# EAGLE design generator (EAGLE 7.1.0)
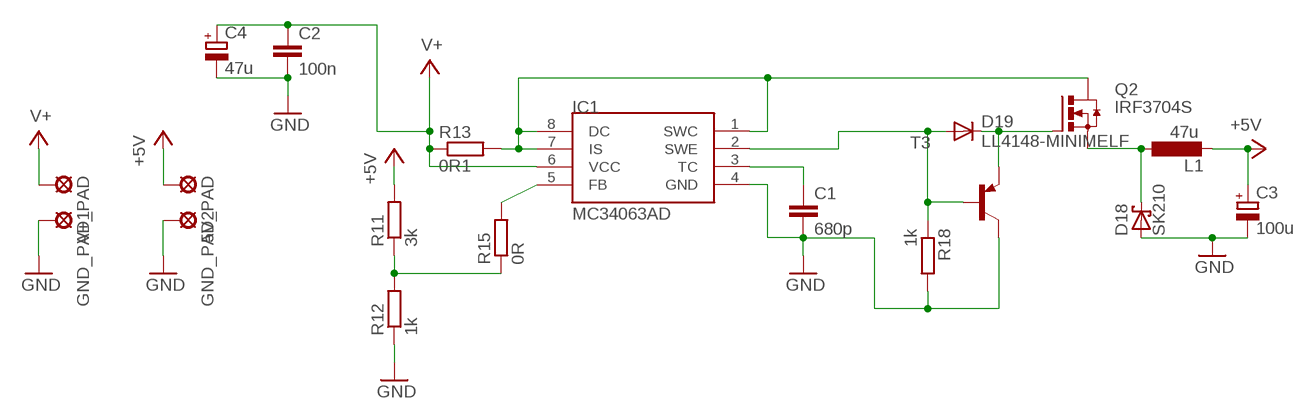
[diagram p0: schematic, sheet 1]

## Parts
5V_PAD  LSP10  [LSP10]
C1  680p  C-EUC0805  [C0805]
C2  100n  C-EUC0805  [C0805]
C3  100u  CPOL-EUD  [PANASONIC_D]
C4  47u  CPOL-EUE3.5-10  [E3,5-10]
D18  SK210  SCHOTTKY-DIODESMD  [SMB]
D19  LL4148-MINIMELF  PMLL41SOD80C  [SOD80C]
GND_PAD1  LSP10  [LSP10]
GND_PAD2  LSP10  [LSP10]
IC1  MC34063AD  [SOIC8]
L1  47u  L-EUTJ3-U1  [TJ3-U1]
Q2  IRF3704S  [D2PACK]
R11  3k  R-EU_R0805  [R0805]
R12  1k  R-EU_R0805  [R0805]
R13  0R1  R-EU_R0805  [R0805]
R15  0R  R-EU_R1206  [R1206]
R18  1k  R-EU_R0805  [R0805]
T3  BC807-16-PNP-SOT23-BEC  [SOT23-BEC]
V+_PAD  LSP10  [LSP10]

## Nets
+5V: 5V_PAD.MP C3.+ L1.2 R11.2
GND: C1.2 C2.2 C3.- C4.- D18.A GND_PAD1.MP GND_PAD2.MP IC1.4(GND) R12.1 R18.2 T3.C
N$11: R11.1 R12.2 R15.1
N$15: D19.C Q2.1(G) T3.E
N$16: C1.1 IC1.3(TC)
N$19: D18.C L1.1 Q2.3(S)
N$21: IC1.5(FB) R15.2
N$27: IC1.1(SWC) IC1.7(IS) IC1.8(DC) Q2.2(D) R13.2
N$28: D19.A IC1.2(SWE) R18.1 T3.B
V+: C2.1 C4.+ IC1.6(VCC) R13.1 V+_PAD.MP

## Library data of the parts
5V_PAD GND_PAD1 GND_PAD2 V+_PAD = solpad:LSP10: SOLDER PAD drill 1.0 mm, distributor Buerklin, 12H555
C1 C2 = rcl:C-EU: CAPACITOR, European symbol
C3 C4 = rcl:CPOL-EU: POLARIZED CAPACITOR, European symbol
D18 = diode:SCHOTTKY-DIODE: Schottky Diode
D19 = diode:PMLL41*: High-speed diodes Source: http://www.semiconductors.philips.com/acrobat_download/datasheets/PMLL4150_2.pdf
IC1 = mc34063:MC34063
L1 = rcl:L-EU: INDUCTOR, European symbol
Q2 = transistor-power:IRF3704: SMPS MOSFET HEXFET® Power MOSFET Source: http://www.irf.com/product-info/datasheets/data/irf3704.pdf
R11-R13 R15 = rcl:R-EU_: RESISTOR, European symbol
R18 = resistor:R-EU_: RESISTOR, European symbol
T3 = transistor:*-PNP-: PNP Transistror

## Board
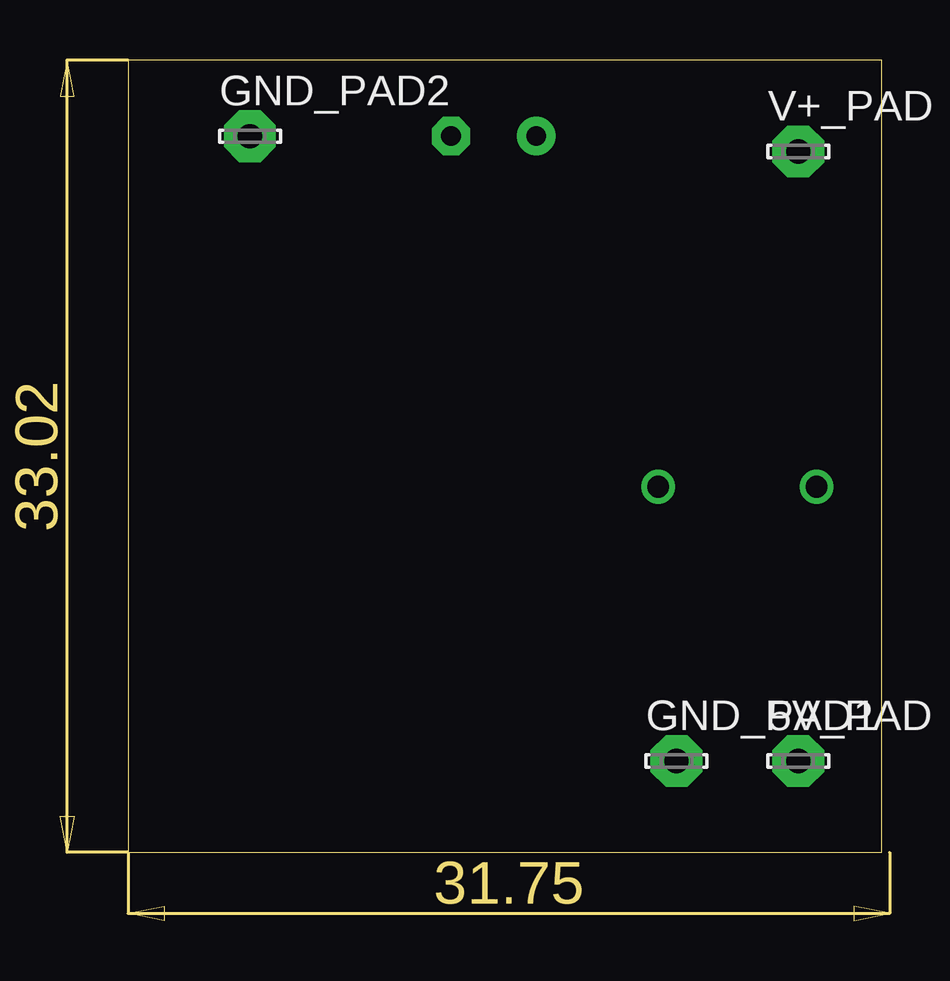
[diagram p1: board, top side]
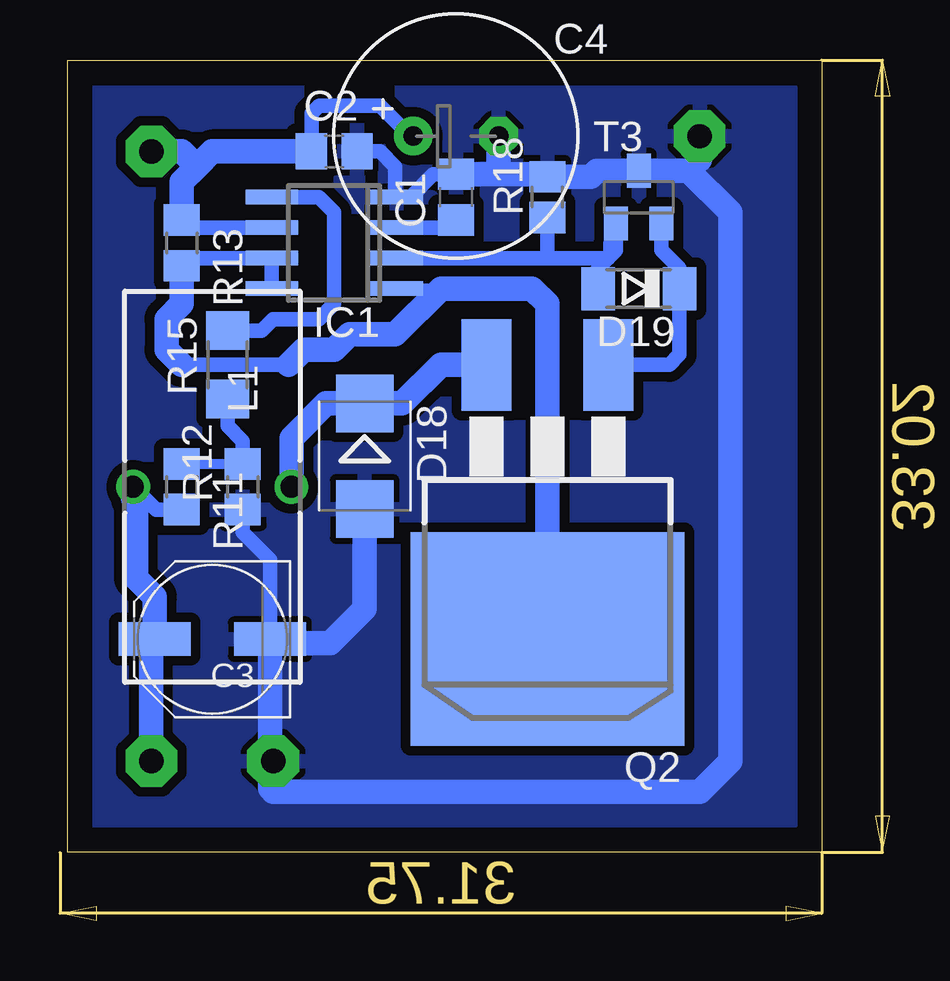
[diagram p2: board, bottom side, seen from below]

Size 31.42 x 33.01 mm. Coordinates in mm from the lower left corner, seen from the top.
Outline: 0,0 31.42,0 31.42,33.01 0,33.01 0,0
Copper layers (1*16): Top 0.035mm / dielectric 1.5mm / Bottom 0.035mm
Design rules "default": minimum track width 10mil, minimum drill 24mil, track to track 8mil, track to pad 8mil, pad to pad 8mil, via to via 8mil, smd to smd 8mil, copper to edge 40mil, drill to drill 8mil, minimum pad ring 10mil, minimum via ring 8mil, stop-mask expansion 4mil, vias tented up to drill 0mil, thermal gap 10mil

### Footprints (pad centres in the part's own frame; a part is rotated, then mirrored left to right if it is on the bottom)
LSP10 = drill 1.016 pad 2.159 octagon: MP 0,0
C0805 = smd 1.3 x 1.5: 1 -0.95,0; 2 0.95,0
PANASONIC_D = smd 3 x 1.4: + 2.4,0; - -2.4,0
E3,5-10 = drill 0.813 pad 1.6: + -1.778,0 | drill 0.813 pad 1.6 octagon: - 1.778,0
SMB = smd 2.4 x 2.4: A 2.2,0; C -2.2,0
SOD80C = smd 1.4 x 1.8: A 1.7,0; C -1.7,0
SOIC8 = smd 0.6 x 2.2: 1 -1.905,-2.6; 2 -0.635,-2.6; 3 0.635,-2.6; 4 1.905,-2.6; 5 1.905,2.6; 6 0.635,2.6; 7 -0.635,2.6; 8 -1.905,2.6
TJ3-U1 = drill 0.9: 1 -3.3,0; 2 3.3,0
D2PACK = smd 2.083 x 3.81: 1 -2.54,-8.89; 3 2.54,-8.89 | smd 11.43 x 8.89: 2 0,2.54
R0805 = smd 1.3 x 1.5: 1 -0.95,0; 2 0.95,0
R1206 = smd 1.6 x 1.803: 1 -1.422,0; 2 1.422,0
R0805' = smd 1.3 x 1.5: 1 -0.85,0; 2 0.85,0
SOT23-BEC = smd 1 x 1.4: B -0.95,-1.1; C 0,1.1; E 0.95,-1.1

### Placement (x,y rotation side)
5V_PAD  27.94,3.81 0 top
C1  15.24,27.31 90 bottom
C2  20.32,29.21 0 bottom
C3  25.4,8.89 180 bottom
C4  15.24,29.85 0 bottom
D18  19.05,16.51 270 bottom
D19  7.62,23.5 180 bottom
GND_PAD1  22.86,3.81 0 top
GND_PAD2  5.08,29.85 0 top
IC1  20.32,25.4 90 bottom
L1  25.4,15.24 180 bottom
Q2  11.43,11.43 180 bottom
R11  26.67,15.24 270 bottom
R12  24.13,15.24 90 bottom
R13  26.67,25.4 270 bottom
R15  24.77,20.32 90 bottom
R18  1k  [R0805']  11.43,27.31 90 bottom
T3  7.62,27.31 0 bottom
V+_PAD  27.94,29.21 0 top

### Tracks (layer width: path | path; a pad name or v marks a point on that pad's centre or on a via)
+5V
  Bottom 0.406: 27.94,8.75 C3.+
  Bottom 0.61: R11.2 27.75,14.29 L1.2
  Bottom 1.016: C3.+ 27.8,10.66 28.58,11.43 28.58,14.61 28.7,14.73 L1.2 | 5V_PAD.MP 27.94,8.75
GND
  Bottom 0.406: 23,2.68 22.86,2.54 | 22.82,8.71 C3.- | 12.17,28.25 R18.2 | 17.14,27.31 IC1.4 17.78,27.36 | 13.46,28.76 13.97,28.25 | 5.08,28.87 5.55,28.4
  Bottom 0.61: R12.1 24.13,13.34 23,12.21 C3.- | 17.14,27.31 16.2,28.25 C1.2 | C2.2 18.42,29.21 17.78,28.57 17.78,27.36
  Bottom 1.016: 22.86,2.54 5.08,2.54 3.81,3.81 3.81,26.67 5.55,28.4 T3.C 9.36,28.4 9.61,28.15 R18.2 | C3.- 23,2.68 | 22.82,8.71 20.5,8.71 19.05,10.16 D18.A | 12.17,28.25 13.97,28.25 C1.2 | C4.- 13.46,28.76 | GND_PAD2.MP 5.08,28.87
  pour Bottom (isolate 0.406): 2.54,1.27 30.48,1.27 30.48,31.75 1.27,31.75 1.27,1.27
N$11
  Bottom 0.406: R11.1 R12.2
  Bottom 0.61: R15.1 24.77,17.78 24.13,17.14 R12.2
N$15
  Bottom 0.61: T3.E 6.67,25.08 5.92,24.33 D19.C 5.92,20.75 6.35,20.32 Q2.1
N$16
  Bottom 0.406: 15.56,26.04 C1.1
  Bottom 0.61: IC1.3 15.56,26.04
N$19
  Bottom 1.016: Q2.3 15.88,20.32 17.48,18.71 D18.C 20.66,18.71 22.1,17.27 L1.1
N$21
  Bottom 0.61: IC1.5 20.95,27.31 20.32,26.67 20.32,22.86 20.95,22.22 22.86,22.22 23.34,21.74 R15.2
N$27
  Bottom 0.406: 26.36,24.77 R13.2 | 17.78,23.5 IC1.1 15.88,23.5
  Bottom 0.61: IC1.8 IC1.7 26.36,24.77 | 26.67,20.32 22.23,20.32
  Bottom 1.016: Q2.2 11.43,22.86 12.07,23.5 15.88,23.5 17.78,21.59 19.69,21.59 20.32,20.96 21.59,20.96 22.23,20.32 | R13.2 26.67,22.86 27.31,22.22 27.31,20.96 26.67,20.32
N$28
  Bottom 0.406: 8.89,24.77 8.89,25.4 8.57,25.4
  Bottom 0.61: T3.B 8.57,25.4 8.57,25.08 9.32,24.33 D19.A | IC1.2 11.43,24.77 | 11.43,24.77 8.89,24.77 | R18.1 11.43,24.77
V+
  Bottom 0.406: 26.67,26.04 R13.1
  Bottom 0.61: IC1.6 26.67,26.04 | C4.+ 17.14,29.85 18.42,31.11 20.95,31.11 21.27,30.8 C2.1
  Bottom 1.016: C2.1 25.4,29.21 26.03,28.57 | 26.03,28.57 26.67,27.94 R13.1 | V+_PAD.MP 26.67,29.21 26.03,28.57